# EAGLE schematic psg-dual-ad9833-simp (EAGLE 6.6.0)
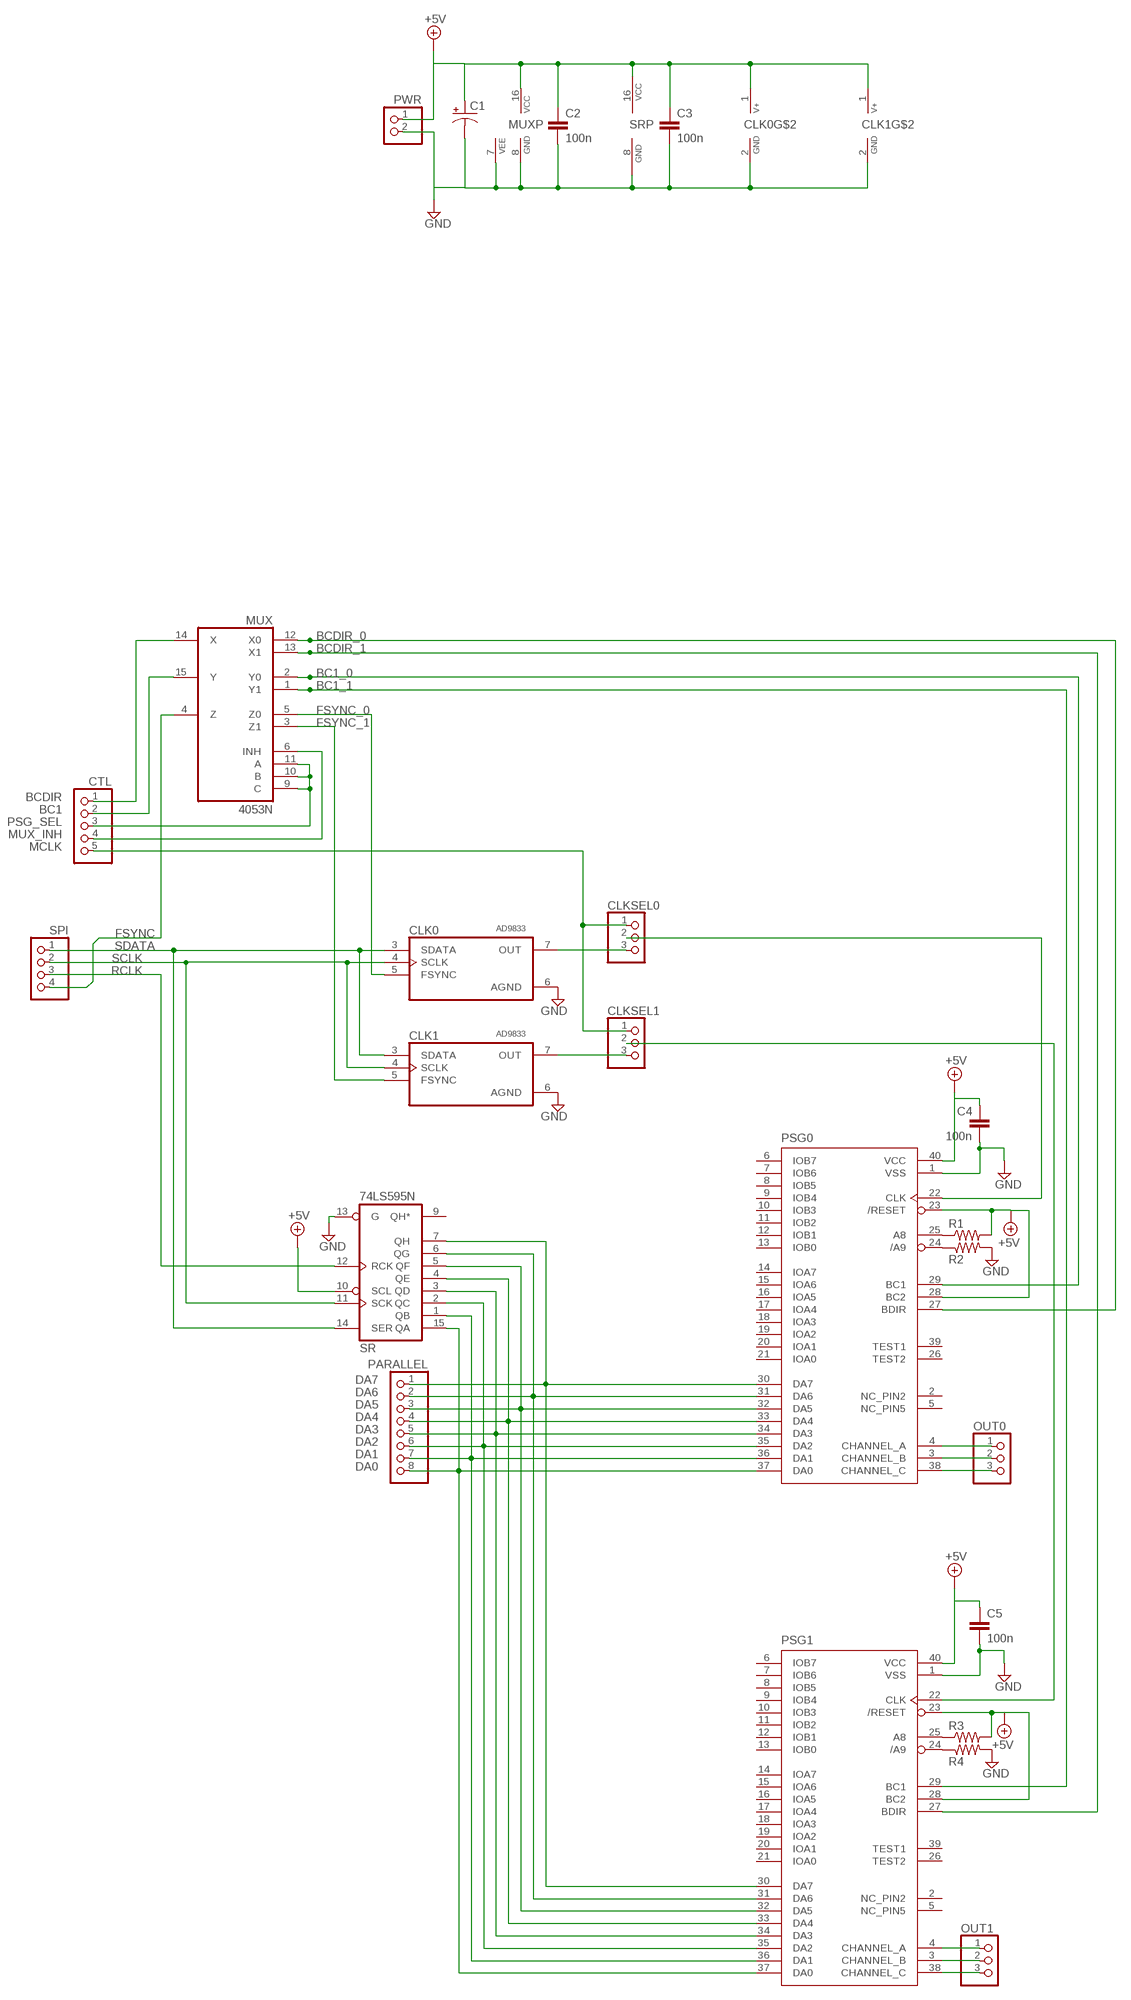
[diagram p0: schematic, sheet 1]

## Parts
C1  0501  [050_020_1]
C2  100n  050X030_0251  [050X030_025]
C3  100n  050X030_0251  [050X030_025]
C4  100n  050X030_0253  [050X030_025_3]
C5  100n  050X030_0253  [050X030_025_3]
CLK0  AD9833_MODULE  [AD9833_MODULE]
CLK1  AD9833_MODULE  [AD9833_MODULE]
CLKSEL0  PINHD-1X3/90  [1X03/90]
CLKSEL1  PINHD-1X3/90  [1X03/90]
CTL  PINHD-1X5/90  [1X05/90]
MUX  4053N  [DIL16]
OUT0  PINHD-1X3/90  [1X03/90]
OUT1  PINHD-1X3/90  [1X03/90]
PARALLEL  PINHD-1X8/90  [1X08/90]
PSG0  AY-3-8910  [DIL40]
PSG1  AY-3-8910  [DIL40]
PWR  PINHD-1X2/90  [1X02/90]
R1  6MM.3  [R0207/3]
R2  6MM.3  [R0207/3]
R3  6MM.3  [R0207/3]
R4  6MM.3  [R0207/3]
SPI  PINHD-1X4/90  [1X04/90]
SR  74LS595N  [DIL16]

## Nets
+5V: C1.+ C2.1 C3.1 C4.1 C5.1 CLK0.1(+V) CLK1.1(+V) MUX.16(VCC) PSG0.23(/RESET) PSG0.28(BC2) PSG0.40(VCC) PSG1.23(/RESET) PSG1.28(BC2) PSG1.40(VCC) PWR.1 R1.2 R3.2 SR.10(SCL) SR.16(VCC)
BC1: CTL.2 MUX.15(Y)
BC1_0: MUX.2(Y0) PSG0.29(BC1)
BC1_1: MUX.1(Y1) PSG1.29(BC1)
BCDIR: CTL.1 MUX.14(X)
BCDIR_0: MUX.12(X0) PSG0.27(BDIR)
BCDIR_1: MUX.13(X1) PSG1.27(BDIR)
CLK_1: CLKSEL1.2 PSG1.22(CLK)
CLK_IN_0: CLKSEL0.2 PSG0.22(CLK)
DA0: PARALLEL.8 PSG0.37(DA0) PSG1.37(DA0) SR.15(QA)
DA1: PARALLEL.7 PSG0.36(DA1) PSG1.36(DA1) SR.1(QB)
DA2: PARALLEL.6 PSG0.35(DA2) PSG1.35(DA2) SR.2(QC)
DA3: PARALLEL.5 PSG0.34(DA3) PSG1.34(DA3) SR.3(QD)
DA4: PARALLEL.4 PSG0.33(DA4) PSG1.33(DA4) SR.4(QE)
DA5: PARALLEL.3 PSG0.32(DA5) PSG1.32(DA5) SR.5(QF)
DA6: PARALLEL.2 PSG0.31(DA6) PSG1.31(DA6) SR.6(QG)
DA7: PARALLEL.1 PSG0.30(DA7) PSG1.30(DA7) SR.7(QH)
FSYNC: MUX.4(Z) SPI.4
FSYNC_0: CLK0.5(FSYNC) MUX.5(Z0)
FSYNC_1: CLK1.5(FSYNC) MUX.3(Z1)
GND: C1.- C2.2 C3.2 C4.2 C5.2 CLK0.2(GND) CLK0.6(AGND) CLK1.2(GND) CLK1.6(AGND) MUX.7(VEE) MUX.8(GND) PSG0.1(VSS) PSG1.1(VSS) PWR.2 R2.2 R4.2 SR.8(GND) SR.13(G)
MCLK: CLKSEL0.1 CLKSEL1.1 CTL.5
MUX_INH: CTL.4 MUX.6(INH)
N$1: OUT0.1 PSG0.4(CHANNEL_A)
N$2: CLK0.7(OUT) CLKSEL0.3
N$3: OUT0.2 PSG0.3(CHANNEL_B)
N$4: OUT0.3 PSG0.38(CHANNEL_C)
N$5: CLK1.7(OUT) CLKSEL1.3
N$9: OUT1.1 PSG1.4(CHANNEL_A)
N$10: OUT1.2 PSG1.3(CHANNEL_B)
N$11: OUT1.3 PSG1.38(CHANNEL_C)
N$12: PSG1.25(A8) R3.1
N$13: PSG1.24(/A9) R4.1
N$14: PSG0.24(/A9) R2.1
N$15: PSG0.25(A8) R1.1
PSG_SEL: CTL.3 MUX.9(C) MUX.10(B) MUX.11(A)
RCLK: SPI.3 SR.12(RCK)
SCLK: CLK0.4(SCLK) CLK1.4(SCLK) SPI.2 SR.11(SCK)
SDATA: CLK0.3(SDATA) CLK1.3(SDATA) SPI.1 SR.14(SER)
Unconnected: PSG0.2(NC_PIN2) PSG0.5(NC_PIN5) PSG0.6(IOB7) PSG0.7(IOB6) PSG0.8(IOB5) PSG0.9(IOB4) PSG0.10(IOB3) PSG0.11(IOB2) PSG0.12(IOB1) PSG0.13(IOB0) PSG0.14(IOA7) PSG0.15(IOA6) PSG0.16(IOA5) PSG0.17(IOA4) PSG0.18(IOA3) PSG0.19(IOA2) PSG0.20(IOA1) PSG0.21(IOA0) PSG0.26(TEST2) PSG0.39(TEST1) PSG1.2(NC_PIN2) PSG1.5(NC_PIN5) PSG1.6(IOB7) PSG1.7(IOB6) PSG1.8(IOB5) PSG1.9(IOB4) PSG1.10(IOB3) PSG1.11(IOB2) PSG1.12(IOB1) PSG1.13(IOB0) PSG1.14(IOA7) PSG1.15(IOA6) PSG1.16(IOA5) PSG1.17(IOA4) PSG1.18(IOA3) PSG1.19(IOA2) PSG1.20(IOA1) PSG1.21(IOA0) PSG1.26(TEST2) PSG1.39(TEST1) SR.9(QH*)

## Library data of the parts
C1 = gm-caps-electro-pol:050: 0.22 - 100uF Xicon values at Mouser.com: 10V: 10 - 100uF; 16V: 2.2 - 47uF; 25V: 0.47 - 47uF; 50V: 0.22 - 22uF
C2-C5 = gm-caps-ceramic:050X030_025: 47 - 120pF Xicon Ceramic Disc 2.5mm lead spacing
CLK0 CLK1 = jaapie:AD9833_MODULE
CLKSEL0 CLKSEL1 OUT0 OUT1 = pinhead:PINHD-1X3: PIN HEADER
CTL = pinhead:PINHD-1X5: PIN HEADER
MUX = 40xx:4053: Triple 2-channel ANALOG MULTIPLEXER
PARALLEL = pinhead:PINHD-1X8: PIN HEADER
PSG0 PSG1 = 8Bit_Parts:AY-3-8910
PWR = pinhead:PINHD-1X2: PIN HEADER
R1-R4 = gm-resistors:6MM: 6mm Resistors Leads spaced 1-6 holes apart for 0.1" perfboard. Suitable for 1/4 watt resistors.
SPI = pinhead:PINHD-1X4: PIN HEADER
SR = 74xx-us:74*595: 8-bit SHIFT REGISTER, output latch